# EAGLE design BeebOPL (EAGLE 7.7.0)
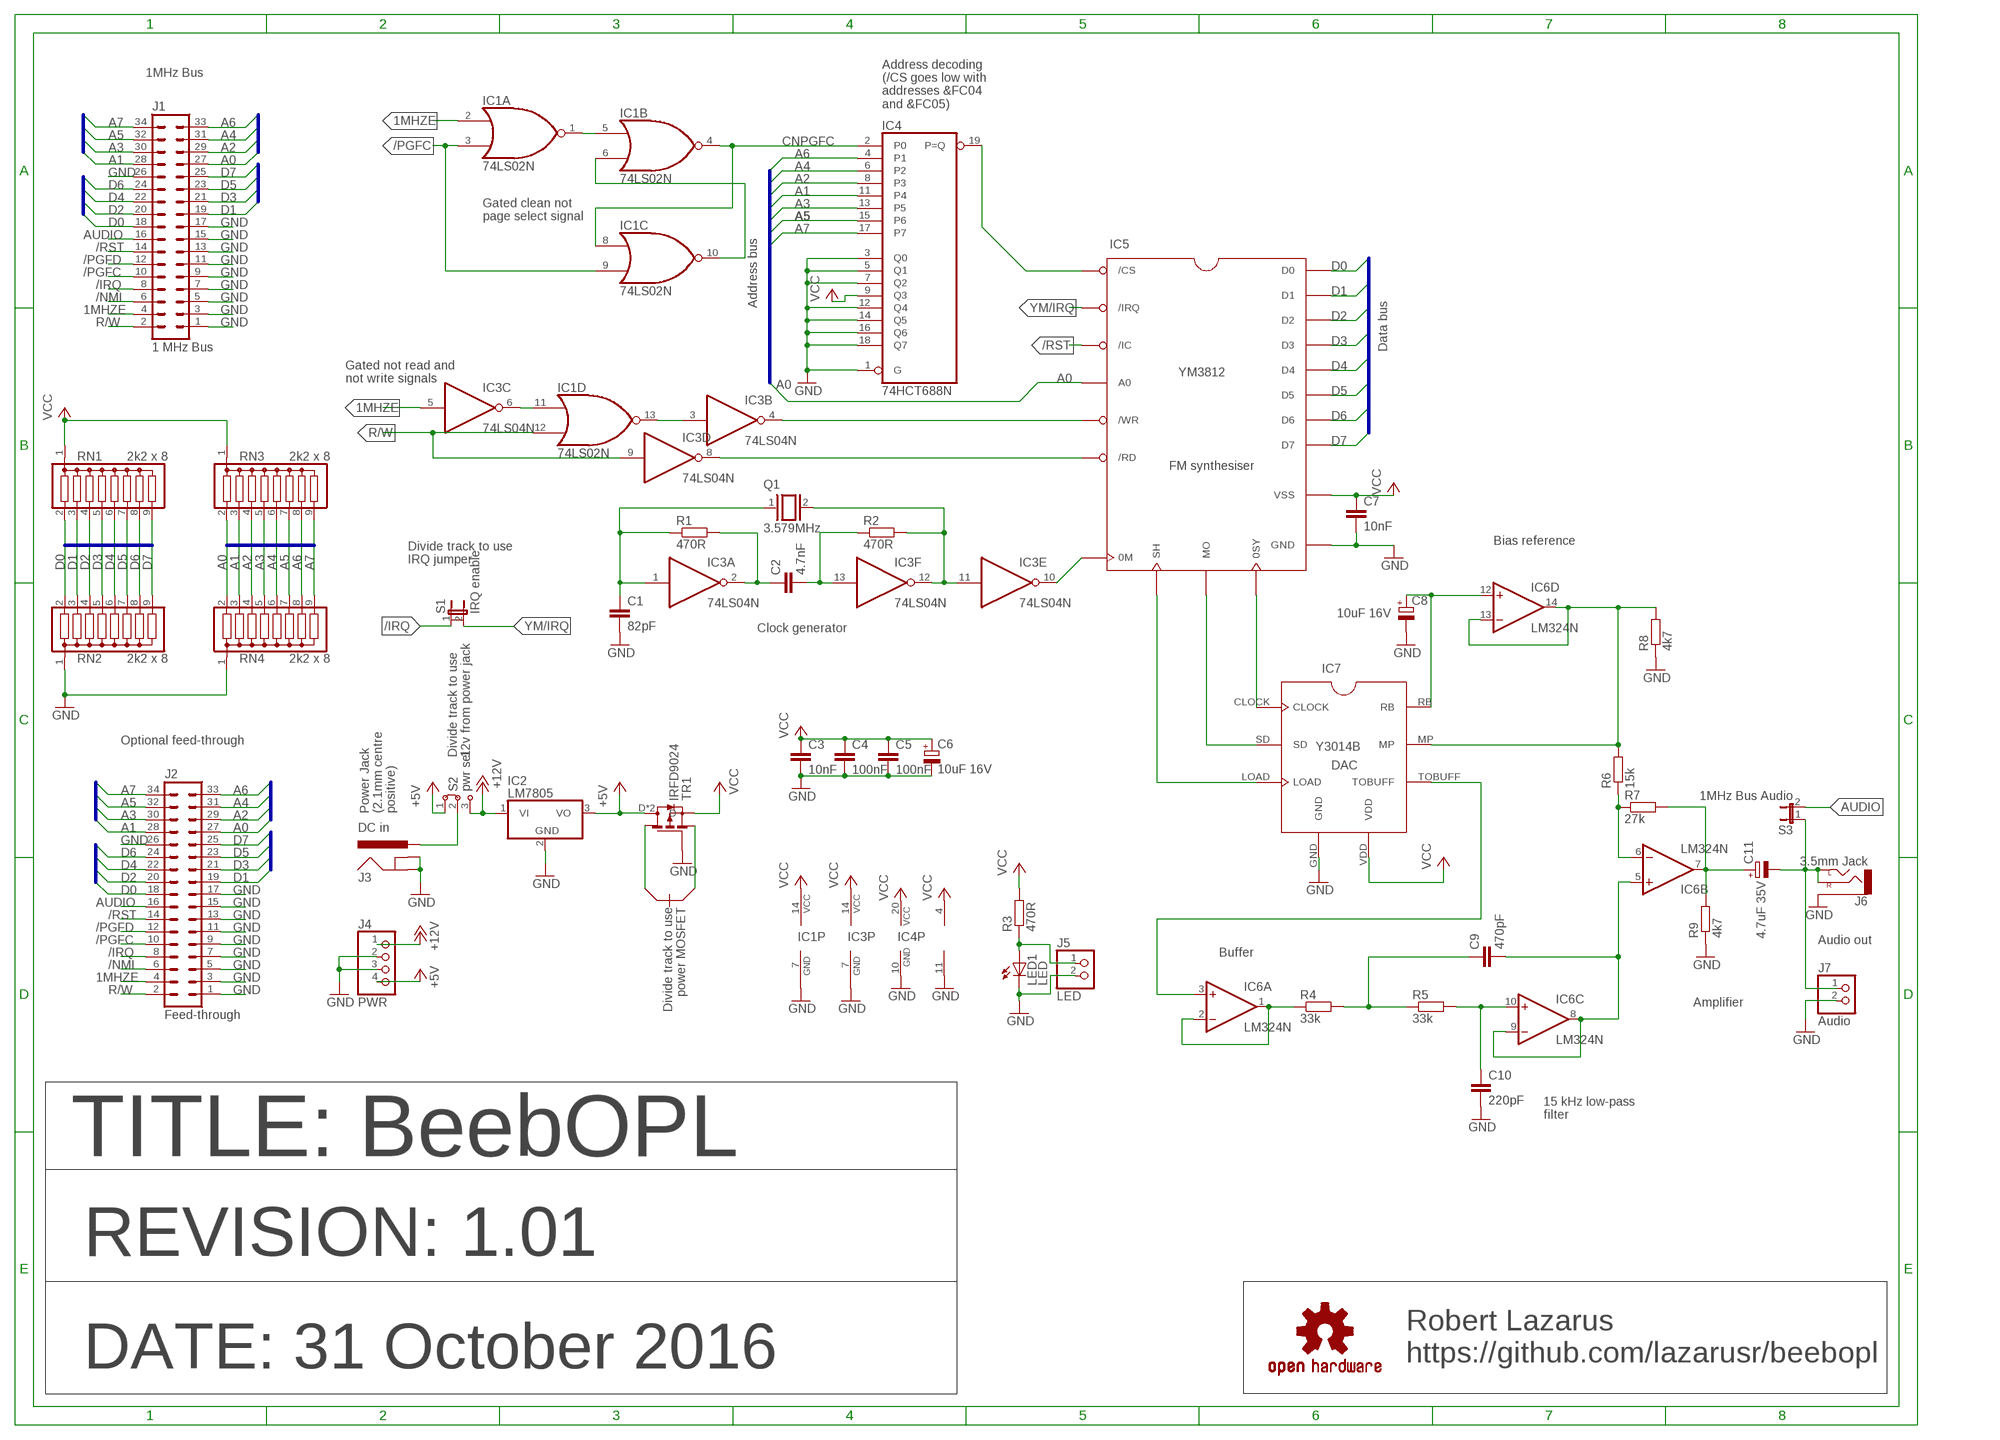
[diagram p0: schematic, sheet 1]

## Parts
C1  82pF  C-EU050-024X044  [C050-024X044]
C2  4.7nF  C-EU050-024X044  [C050-024X044]
C3  10nF  C-EU050-024X044  [C050-024X044]
C4  100nF  C-EU050-024X044  [C050-024X044]
C5  100nF  C-EU050-024X044  [C050-024X044]
C6  10uF 16V  CPOL-EUE2.5-5  [E2,5-5]
C7  10nF  C-EU050-024X044  [C050-024X044]
C8  10uF 16V  CPOL-EUE2.5-5  [E2,5-5]
C9  470pF  C-EU050-024X044  [C050-024X044]
C10  220pF  C-EU050-024X044  [C050-024X044]
C11  4.7uF 35V  CPOL-EUE2.5-5  [E2,5-5]
IC1  74LS02N  [DIL14]
IC2  LM7805  7805TV  [TO220V]
IC3  74LS04N  [DIL14]
IC4  74HCT688N  [DIL20]
IC5  YM3812  YM3812-DIP24  [YM3812]
IC6  LM324N  [DIL14]
IC7  Y3014B  YM3014B-DIP8  [YM3014B]
J1  1 MHz Bus  ML34  [ML34]
J2  Feed-through  ML34  [ML34]
J3  DC in  POWER_JACKSLT  [POWER_JACK_SLOT]
J4  PWR  PINHD-1X4  [1X04]
J5  LED  PINHD-1X2  [1X02]
J6  3.5mm Jack  AUDIO-JACKPTH  [AUDIO-JACK]
J7  Audio  PINHD-1X2  [1X02]
LED1  LED  LED5MM  [LED5MM]
LOGO1  OSHW-LOGO-BOTTOML  [OSHW-LOGO-L]
Q1  3.579MHz  XTAL/S  [QS]
R1  470R  R-EU_0207/10  [0207/10]
R2  470R  R-EU_0207/10  [0207/10]
R3  470R  R-EU_0207/10  [0207/10]
R4  33k  R-EU_0207/10  [0207/10]
R5  33k  R-EU_0207/10  [0207/10]
R6  15k  R-EU_0207/10  [0207/10]
R7  27k  R-EU_0207/10  [0207/10]
R8  4k7  R-EU_0207/10  [0207/10]
R9  4k7  R-EU_0207/10  [0207/10]
RN1  2k2 x 8  G08R  [SIL9]
RN2  2k2 x 8  G08R  [SIL9]
RN3  2k2 x 8  G08R  [SIL9]
RN4  2k2 x 8  G08R  [SIL9]
S1  IRQ enable  JUMPER-2PTH  [1X02]
S2  pwr sel  J2  [S_3WAY_OR]
S3  1MHz Bus Audio  JUMPER-2PTH  [1X02]
TR1  IRFD9024  IRFD9024-OPTN  [FET-DIL-OPTN]

## Nets
1MHZE: IC1.2(A:I0) IC3.5(C:I) J1.4 J2.4
+5V [pwr]: IC2.3(VO) J4.4 S2.1 TR1.D TR1.D1(D)
+12V [pwr]: IC2.1(VI) J4.1 S2.3
/IRQ: J1.8 J2.8 S1.1
/NMI: J1.6 J2.6
/PGFC: IC1.3(A:I1) IC1.9(C:I1) J1.10 J2.10
/PGFD: J1.12 J2.12
/RST: IC5./IC J1.14 J2.14
A0: IC5.A0 J1.27 J2.27 RN3.2 RN4.2
A1: IC4.11(P4) J1.28 J2.28 RN3.3 RN4.3
A2: IC4.8(P3) J1.29 J2.29 RN3.4 RN4.4
A3: IC4.13(P5) J1.30 J2.30 RN3.5 RN4.5
A4: IC4.6(P2) J1.31 J2.31 RN3.6 RN4.6
A5: IC4.15(P6) J1.32 J2.32 RN3.7 RN4.7
A6: IC4.4(P1) J1.33 J2.33 RN3.8 RN4.8
A7: IC4.17(P7) J1.34 J2.34 RN3.9 RN4.9
AUDIO [audio]: J1.16 J2.16 S3.2
AUDIO_OUT [audio]: C11.- J6.RING(RIGHT) J6.TIP(LEFT) J7.1 S3.1
CNPGFC: IC1.4(B:O) IC1.8(C:I0) IC4.2(P0)
D0: IC5.D0 J1.18 J2.18 RN1.2 RN2.2
D1: IC5.D1 J1.19 J2.19 RN1.3 RN2.3
D2: IC5.D2 J1.20 J2.20 RN1.4 RN2.4
D3: IC5.D3 J1.21 J2.21 RN1.5 RN2.5
D4: IC5.D4 J1.22 J2.22 RN1.6 RN2.6
D5: IC5.D5 J1.23 J2.23 RN1.7 RN2.7
D6: IC5.D6 J1.24 J2.24 RN1.8 RN2.8
D7: IC5.D7 J1.25 J2.25 RN1.9 RN2.9
DC [pwr]: J3.PWR S2.2
GND [gnd]: C1.2 C3.2 C4.2 C5.2 C6.- C7.2 C8.- C10.2 IC1.7(P:GND) IC2.2(GND) IC3.7(P:GND) IC4.1(G) IC4.3(Q0) IC4.5(Q1) IC4.7(Q2) IC4.10(GND) IC4.12(Q4) IC4.14(Q5) IC4.16(Q6) IC4.18(Q7) IC5.GND IC6.11(P:V-) IC7.GND J1.1 J1.3 J1.5 J1.7 J1.9 J1.11 J1.13 J1.15 J1.17 J1.26 J2.1 J2.3 J2.5 J2.7 J2.9 J2.11 J2.13 J2.15 J2.17 J2.26 J3.GND@1(GNDBREAK) J3.GND@2(GND) J4.2 J4.3 J5.2 J6.SLEEVE J7.2 LED1.K(C) R8.1 R9.1 RN2.1 RN4.1 TR1.G
N$1: C2.1 IC3.2(A:O) R1.2
N$2: IC1.13(D:O) IC3.3(B:I)
N$3: IC1.11(D:I0) IC3.6(C:O)
N$5: C2.2 IC3.13(F:I) R2.1
N$6: IC5.SH IC7.LOAD
N$7: IC5.MO IC7.SD
N$8: IC5.0SY IC7.CLOCK
N$9: C1.1 IC3.1(A:I) Q1.1 R1.1
N$10: IC1.1(A:O) IC1.5(B:I0)
N$11 [audio]: C8.+ IC6.12(D:+IN) IC7.RB
N$12: IC1.6(B:I1) IC1.10(C:O)
N$13 [audio]: IC6.13(D:-IN) IC6.14(D:OUT) IC7.MP R6.2 R8.2
N$14: IC3.8(D:O) IC5./RD
N$15 [audio]: IC6.6(B:-IN) R6.1 R7.1
N$16 [audio]: C11.+ IC6.7(B:OUT) R7.2 R9.2
N$18 [audio]: IC6.3(A:+IN) IC7.TOBUFF
N$19 [audio]: IC6.1(A:OUT) IC6.2(A:-IN) R4.1
N$20 [audio]: C9.1 R4.2 R5.1
N$21 [audio]: C10.1 IC6.10(C:+IN) R5.2
N$22 [audio]: C9.2 IC6.5(B:+IN) IC6.8(C:OUT) IC6.9(C:-IN)
N$23: IC4.19(P=Q) IC5./CS
N$24: IC3.4(B:O) IC5./WR
N$25: J5.1 LED1.A R3.1
N$26: IC3.10(E:O) IC5.0M
N$28: IC3.11(E:I) IC3.12(F:O) Q1.2 R2.2
R/W: IC1.12(D:I1) IC3.9(D:I) J1.2 J2.2
VCC [pwr]: C3.1 C4.1 C5.1 C6.+ C7.1 IC1.14(P:VCC) IC3.14(P:VCC) IC4.9(Q3) IC4.20(VCC) IC5.VSS IC6.4(P:V+) IC7.VDD R3.2 RN1.1 RN3.1 TR1.S
YM/IRQ: IC5./IRQ S1.2

## Buses
D[0..7]
A[0..7]

## Notes on the sheet
- 1MHz Bus
- Address decoding
  (/CS goes low with
  addresses &FC04
  and &FC05)
- Gated clean not
  page select signal
- Address bus
- Data bus
- Gated not read and
  not write signals
- FM synthesiser
- Bias reference
- Divide track to use
  IRQ jumper
- Clock generator
- Optional feed-through
- Divide track to use
  12v from power jack
- DAC
- Power Jack
  (2.1mm centre
  positive)
- Divide track to use
  power MOSFET
- Audio out
- Buffer
- Amplifier
- 15 kHz low-pass
  filter
- TITLE: BeebOPL
- REVISION: 1.01
- Robert Lazarus
  https://github.com/lazarusr/beebopl
- DATE: 31 October 2016

## Library data of the parts
C1-C5 C7 C9 C10 = resistor:C-EU: CAPACITOR, European symbol
C6 C8 C11 = YMSynth:CPOL-EU: POLARIZED CAPACITOR, European symbol
IC1 = 74xx-us:74*02: Quad 2-input NOR gate
IC2 = linear:78*: Positive VOLTAGE REGULATOR Source: http://cache.national.com/ds/LM/LM78L05.pdf http://www.fairchildsemi.com/ds/LM/LM7805.pdf
IC3 = 74xx-us:74*04: Hex INVERTER
IC4 = 74xx-eu:74*688: 8-bit MAGNITUDE/IDENTITY COMPARATOR, totem pole
IC5 = YMSynth:YM3812: YM3812
IC6 = linear:LM324: OP AMP
IC7 = YMSynth:YM3014B: YM3014B
J1 J2 = con-harting-ml:ML34: HARTING; OC_FARNELL: unknown; OC_NEWARK: unknown
J3 = SparkFun-Connectors:POWER_JACK: Power Jack This is the standard 5.5mm barrel jack for power. The PTH is the most common, proven, reliable, footprint. The Slot footprint only works if the mill layer is transmitted to the PCB fab house so be warned. Mating wall wart : TOL-00298 (and others); PROD_ID: PRT-00119
J4 = pinhead:PINHD-1X4: PIN HEADER
J5 J7 = pinhead:PINHD-1X2: PIN HEADER
J6 = SparkFun-Connectors:AUDIO-JACK: 3.5mm Audio Jack Simple 3.5mm common PCB mount audio jack. Variant PTH is our storefront SKU PRT-08032
LED1 = led:LED: LED OSRAM: - CHIPLED LG R971, LG N971, LY N971, LG Q971, LY Q971, LO R971, LY R971 LH N974, LH R974 LS Q976, LO Q976, LY Q976 LO Q996 - Hyper CHIPLED LW Q18S LB Q993, LB Q99A, LB R99A - SideLED LS A670, LO A670, LY A670, LG A670, LP A670 LB A673, LV A673, LT A673, LW A673 LH A674 LY A675 LS A676, LA A676, LO A676, LY A676, LW A676 LS A679, LY A679, LG A679 - Hyper Micro SIDELED® LS Y876, LA Y876, LO Y876, LY Y876 LT Y87S - SmartLED LW L88C, LW L88S LB L89C, LB L89S, LG L890 LS L89K, LO L89K, LY L89K LS L896, LA L896, LO L896, LY L896 - TOPLED LS T670, LO T670, LY T670, LG T670, LP T670 LSG T670, LSP T670, LSY T670, LOP T670, LYG T670 LG T671, LOG T671, LSG T671 LB T673, LV T673, LT T673, LW T673 LH T674 LS T676, LA T676, LO T676, LY T676, LB T676, LH T676, LSB T676, LW T676 LB T67C, LV T67C, LT T67C, LS T67K, LO T67K, LY T67K, LW E67C LS E67B, LA E67B, LO E67B, LY E67B, LB E67C, LV E67C, LT E67C LW T67C LS T679, LY T679, LG T679 LS T770, LO T770, LY T770, LG T770, LP T770 LB T773, LV T773, LT T773, LW T773 LH T774 LS E675, LA E675, LY E675, LS T675 LS T776, LA T776, LO T776, LY T776, LB T776 LHGB T686 LT T68C, LB T68C - Hyper Mini TOPLED® LB M676 - Mini TOPLED Santana® LG M470 LS M47K, LO M47K, LY M47K Source: http://www.osram.convergy.de LUXEON: - LUMILED® LXK2-PW12-R00, LXK2-PW12-S00, LXK2-PW14-U00, LXK2-PW14-V00 LXK2-PM12-R00, LXK2-PM12-S00, LXK2-PM14-U00 LXK2-PE12-Q00, LXK2-PE12-R00, LXK2-PE12-S00, LXK2-PE14-T00, LXK2-PE14-U00 LXK2-PB12-K00, LXK2-PB12-L00, LXK2-PB12-M00, LXK2-PB14-N00, LXK2-PB14-P00, LXK2-PB14-Q00 LXK2-PR12-L00, LXK2-PR12-M00, LXK2-PR14-Q00, LXK2-PR14-R00 LXK2-PD12-Q00, LXK2-PD12-R00, LXK2-PD12-S00 LXK2-PH12-R00, LXK2-PH12-S00 LXK2-PL12-P00, LXK2-PL12-Q00, LXK2-PL12-R00 Source: www.luxeon.com KINGBRIGHT: KA-3528ASYC Source: www.kingbright.com
LOGO1 = YMSynth:OSHW-LOGO-BOTTOM: Open Source Hardware Logo This logo indicates the piece of hardware it is found on incorporates a OSHW license and/or adheres to the definition of open source hardware found here: http://freedomdefined.org/OSHW
Q1 = special:XTAL/S: CRYSTAL
R1-R9 = resistor:R-EU_: RESISTOR, European symbol
RN1-RN4 = resistor-sil:G08R: SIL RESISTOR; OC_FARNELL: unknown; OC_NEWARK: unknown
S1 = YMSynth:JUMPER-2: Jumper Basic 0.1" spaced jumper. Use with breakaway headers.
S2 = YMSynth:J2: Jumper switch 2 x 2.5 mm
S3 = SparkFun-Retired:JUMPER-2: Jumper Basic 0.1" spaced jumper. Use with breakaway headers.
TR1 = YMSynth:IRFD9024-OPTN

## Net classes
0 default: width 0.254 mm, clearance 0.152 mm
1 pwr: width 1.016 mm, clearance 0.254 mm
2 audio: width 1.016 mm, clearance 0.254 mm
3 gnd: width 1.016 mm, clearance 0.254 mm

## Board
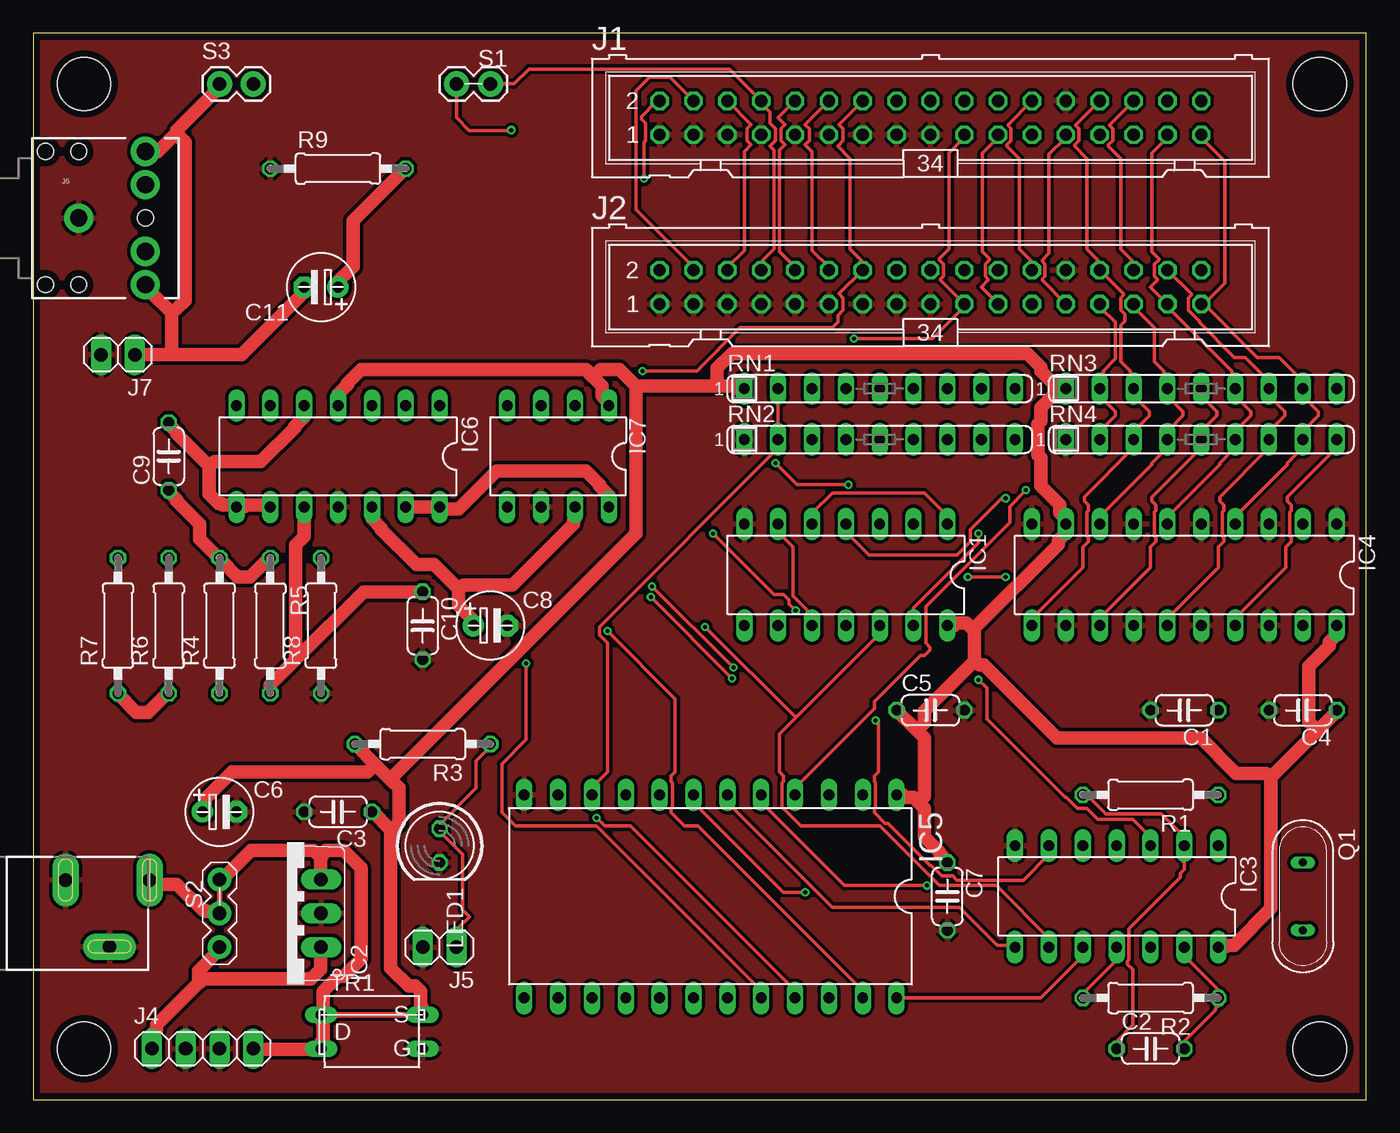
[diagram p1: board, top side]
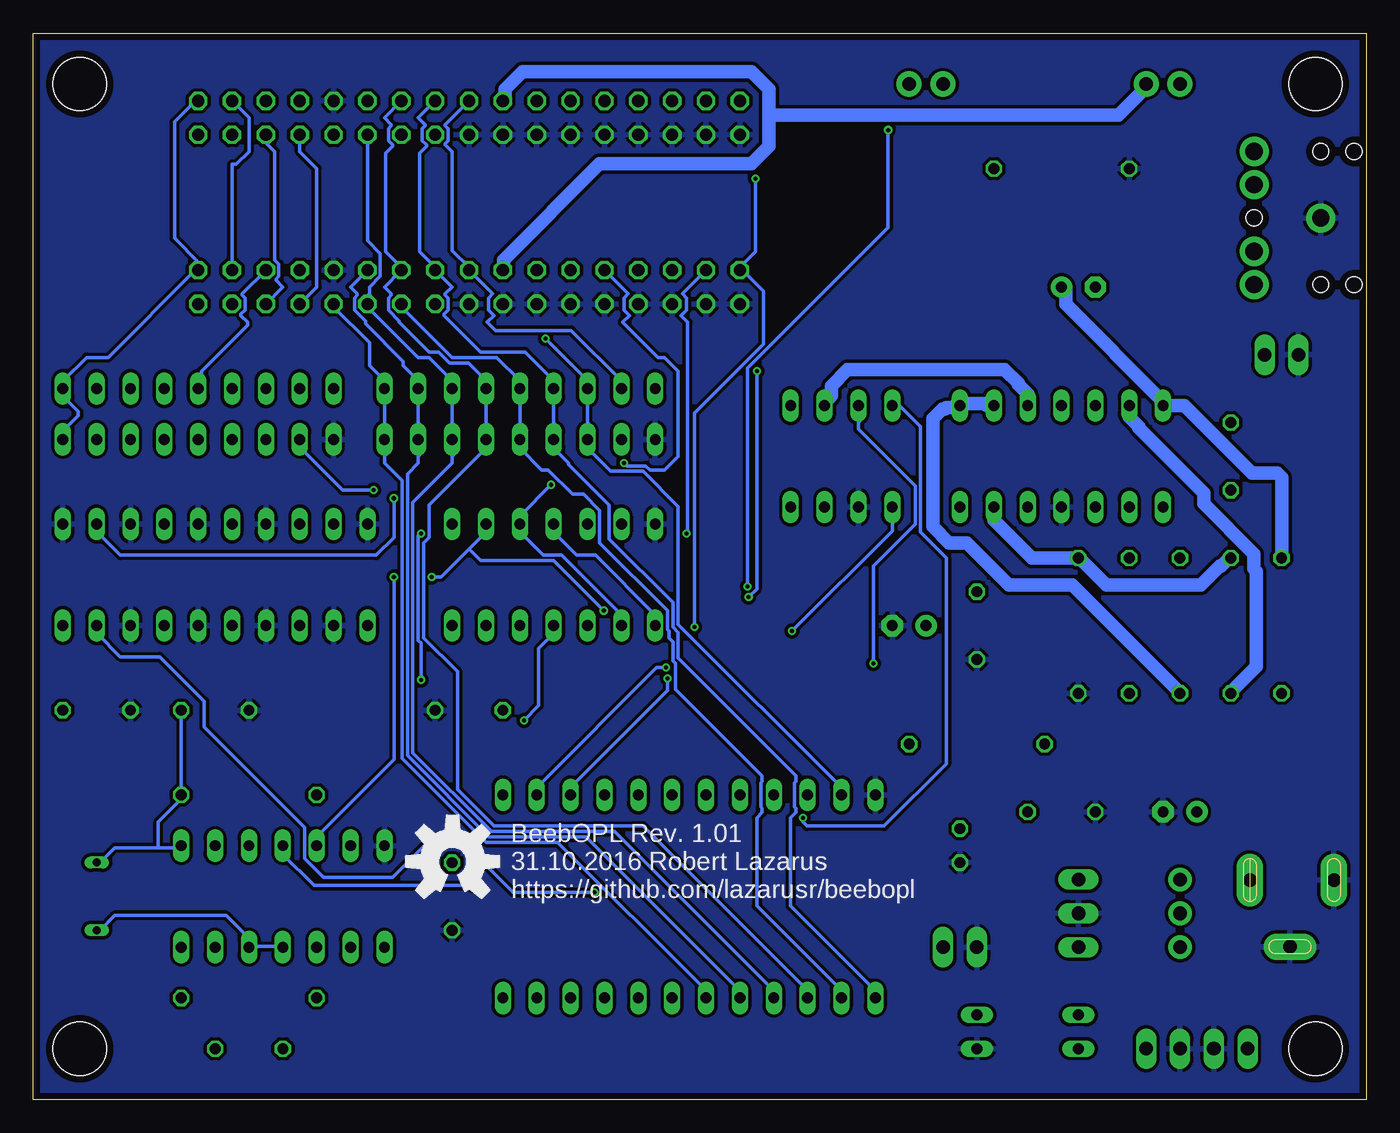
[diagram p2: board, bottom side, seen from below]

Size 100 x 80 mm. Coordinates in mm from the lower left corner, seen from the top.
Outline: 0,0 100,0 100,80 0,80 0,0
Copper layers (1*16): Top 0.035mm / dielectric 1.6mm / Bottom 0.035mm
Design rules "Elecrow_2-layer_PCB_eagle_rule": minimum track width 6mil, minimum drill 12mil, track to track 6mil, track to pad 6mil, pad to pad 6mil, via to via 8mil, smd to smd 0mil, copper to edge 20mil, drill to drill 10mil, minimum pad ring 6mil, minimum via ring 6mil, stop-mask expansion 0mil, vias tented up to drill 100mil, thermal gap 10mil
Holes 4 mm at 96.52,76.2 96.52,3.81 3.81,3.81 3.81,76.2

### Footprints (pad centres in the part's own frame; a part is rotated, then mirrored left to right if it is on the bottom)
C050-024X044 = drill 0.813 octagon: 1 -2.54,0; 2 2.54,0
E2,5-5 = drill 0.813 pad 1.6: + -1.27,0 | drill 0.813 pad 1.6 octagon: - 1.27,0
DIL14 = drill 0.813 long: 1 -7.62,-3.81; 2 -5.08,-3.81; 3 -2.54,-3.81; 4 0,-3.81; 5 2.54,-3.81; 6 5.08,-3.81; 7 7.62,-3.81; 8 7.62,3.81; 9 5.08,3.81; 10 2.54,3.81; 11 0,3.81; 12 -2.54,3.81; 13 -5.08,3.81; 14 -7.62,3.81
TO220V = drill 1.016 long: 1 -2.54,-2.54; 2 0,-2.54; 3 2.54,-2.54
DIL20 = drill 0.813 long: 1 -11.43,-3.81; 2 -8.89,-3.81; 3 -6.35,-3.81; 4 -3.81,-3.81; 5 -1.27,-3.81; 6 1.27,-3.81; 7 3.81,-3.81; 8 6.35,-3.81; 9 8.89,-3.81; 10 11.43,-3.81; 11 11.43,3.81; 12 8.89,3.81; 13 6.35,3.81; 14 3.81,3.81; 15 1.27,3.81; 16 -1.27,3.81; 17 -3.81,3.81; 18 -6.35,3.81; 19 -8.89,3.81; 20 -11.43,3.81
YM3812 = drill 0.813 long: 0M -13.97,7.62; 0SY -11.43,7.62; /CS 1.27,-7.62; /IC -8.89,-7.62; /IRQ -11.43,-7.62; /RD -1.27,-7.62; /WR -3.81,-7.62; A0 -6.35,-7.62; D0 8.89,-7.62; D1 11.43,-7.62; D2 13.97,7.62; D3 11.43,7.62; D4 8.89,7.62; D5 6.35,7.62; D6 3.81,7.62; D7 1.27,7.62; GND 13.97,-7.62; MO -6.35,7.62; NC8 3.81,-7.62; NC9 6.35,-7.62; NC19 -1.27,7.62; NC22 -8.89,7.62; SH -3.81,7.62; VSS -13.97,-7.62
YM3014B = drill 0.813 long: CLOCK 3.81,3.81; GND 1.27,3.81; LOAD 1.27,-3.81; MP -3.81,3.81; RB -1.27,3.81; SD 3.81,-3.81; TOBUFF -1.27,-3.81; VDD -3.81,-3.81
ML34 = drill 0.914 octagon: 1 -20.32,-1.27; 2 -20.32,1.27; 3 -17.78,-1.27; 4 -17.78,1.27; 5 -15.24,-1.27; 6 -15.24,1.27; 7 -12.7,-1.27; 8 -12.7,1.27; 9 -10.16,-1.27; 10 -10.16,1.27; 11 -7.62,-1.27; 12 -7.62,1.27; 13 -5.08,-1.27; 14 -5.08,1.27; 15 -2.54,-1.27; 16 -2.54,1.27; 17 0,-1.27; 18 0,1.27; 19 2.54,-1.27; 20 2.54,1.27; 21 5.08,-1.27; 22 5.08,1.27; 23 7.62,-1.27; 24 7.62,1.27; 25 10.16,-1.27; 26 10.16,1.27; 27 12.7,-1.27; 28 12.7,1.27; 29 15.24,-1.27; 30 15.24,1.27; 31 17.78,-1.27; 32 17.78,1.27; 33 20.32,-1.27; 34 20.32,1.27
POWER_JACK_SLOT = drill 1 pad 2 long: GND@1 2.58,7.5; GND@2 7.58,10.8; PWR 2.58,13.8
1X04 = drill 1.016 long: 1 -3.81,0; 2 -1.27,0; 3 1.27,0; 4 3.81,0
1X02 = drill 1.016 long: 1 -1.27,0; 2 1.27,0
AUDIO-JACK = drill 1.3 pad 2.184: RING 5,5; RSH 5,2.5; SLEEVE 0,0; TIP 5,-5; TSH 5,-2.5 | hole 1.2: 0,5; -2.5,5; -2.5,-5; 0,-5; 5,0
LED5MM = drill 0.813 octagon: A -1.27,0; K 1.27,0
QS = drill 0.61 long: 1 -2.54,0; 2 2.54,0
0207/10 = drill 0.813 octagon: 1 -5.08,0; 2 5.08,0
SIL9 = drill 0.813 long: 1 -10.16,0; 2 -7.62,0; 3 -5.08,0; 4 -2.54,0; 5 0,0; 6 2.54,0; 7 5.08,0; 8 7.62,0; 9 10.16,0
1X02' = drill 1.016 pad 1.88: 1 0,0; 2 2.54,0
S_3WAY_OR = drill 1.016 pad 1.778: 1 -1.27,0; 2 1.27,0; 3 3.81,0
FET-DIL-OPTN = drill 0.813 long: D -3.81,1.27; D1 -3.81,-1.27; G 3.81,-1.27; S 3.81,1.27

### Placement (x,y rotation side)
C1  86.36,29.21 180 top
C2  83.82,3.81 0 top
C3  22.86,21.59 180 top
C4  95.25,29.21 180 top
C5  67.31,29.21 0 top
C6  13.97,21.59 0 top
C7  68.58,15.24 270 top
C8  34.29,35.56 0 top
C9  10.16,48.26 90 top
C10  29.21,35.56 270 top
C11  21.59,60.96 180 top
IC1  60.96,39.37 180 top
IC2  19.05,13.97 90 top
IC3  81.28,15.24 180 top
IC4  86.36,39.37 180 top
IC5  50.8,15.24 180 top
IC6  22.86,48.26 180 top
IC7  39.37,48.26 180 top
J1  67.31,73.66 0 top
J2  67.31,60.96 0 top
J3  -5.08,19.05 270 top
J4  12.7,3.81 0 top
J5  30.48,11.43 180 top
J6  3.4,66.14 0 top
J7  6.35,55.88 180 top
LED1  30.48,19.05 270 top
LOGO1  68.54,17.86 0 top
Q1  95.25,15.24 270 top
R1  83.82,22.86 180 top
R2  83.82,7.62 180 top
R3  29.21,26.67 180 top
R4  13.97,35.56 90 top
R5  17.78,35.56 270 top
R6  10.16,35.56 90 top
R7  6.35,35.56 90 top
R8  21.59,35.56 90 top
R9  22.86,69.85 0 top
RN1  63.5,53.34 0 top
RN2  63.5,49.53 0 top
RN3  87.63,53.34 0 top
RN4  87.63,49.53 0 top
S1  IRQ enable  [1X02']  34.29,76.2 180 top
S2  13.97,15.24 270 top
S3  1MHz Bus Audio  [1X02']  13.97,76.2 0 top
TR1  25.4,5.08 0 top

### Tracks (layer width: path | path; a pad name or v marks a point on that pad's centre or on a via)
1MHZE  (via drill 0.3)
  Top 0.254: J1.4 47.75,76.71 46.23,76.71 45.21,75.69 45.21,66.75 49.48,62.48 49.48,62.28 J2.4 | v70.1,39.22 v72.95,39.22 | v51,42.47 55.58,37.9 56.29,37.9 56.69,37.49 56.69,37.19 v57.2,36.68
  Bottom 0.254: IC3.5 78.74,19.71 72.95,25.5 v72.95,39.22 | v70.1,39.22 69.39,39.22 67.31,41.3 | 67.31,41.3 66.04,42.57 IC1.2 | J2.4 51.31,60.45 51,60.15 51,59.23 51.41,58.83 50.9,58.32 50.9,42.57 v51,42.47 | 67.31,41.3 66.45,40.44 60.96,40.44 v57.2,36.68
+5V
  Top 1.016: J4.4 16.56,3.76 21.54,3.76 TR1.D1 21.64,3.86 21.64,4.37 21.74,4.47 21.74,5.79 21.34,6.2 21.54,6.4 TR1.D 21.74,6.81 21.74,8.13 22.86,9.25 23.27,9.25 24.59,10.57 24.59,17.37 23.27,18.69 21.95,18.69 21.84,18.59 21.54,18.19 | 21.54,18.19 21.54,16.56 IC2.3 | 21.54,18.19 21.03,18.69 16.36,18.69 14.22,16.56 14.02,16.56 S2.1
+12V
  Top 1.016: 12.39,8.74 9.25,5.59 9.25,5.28 8.94,4.98 8.94,3.86 J4.1 | 12.39,8.74 12.39,9.65 13.92,11.18 13.92,11.38 S2.3 | IC2.1 21.54,11.38 21.54,9.75 20.83,9.04 12.8,9.04 12.39,8.74
/IRQ
  Top 0.254: J2.8 54.66,62.28 54.66,62.89 55.58,63.8 55.58,71.22 55.27,71.53 55.68,71.93 55.68,72.85 55.27,73.25 55.27,74.07 54.66,74.68 54.66,74.88 J1.8 52.22,77.32 37.19,77.32 36.07,76.2 S1.1
/NMI
  Top 0.254: J1.6 53.85,73.15 53.54,72.85 53.54,71.93 53.85,71.63 53.34,71.12 53.34,63.7 52.12,62.48 52.12,62.28 J2.6
/PGFC  (via drill 0.3)
  Top 0.254: J1.10 55.88,73.66 56.39,73.15 56.08,72.85 56.08,71.93 56.39,71.63 55.98,71.22 55.98,63.6 57.1,62.48 57.1,62.28 J2.10 | v55.68,47.75 57.3,46.13 v61.16,46.13
  Bottom 0.254: IC1.9 55.88,36.37 60.35,40.84 61.77,40.84 63.5,42.57 IC1.3 63.5,43.79 v61.16,46.13 | J2.10 55.37,60.45 55.68,60.15 55.68,59.23 55.27,58.83 55.78,58.32 53.14,55.68 52.63,55.68 51.61,54.66 51.61,48.26 52.63,47.24 53.75,47.24 54.05,47.55 55.47,47.55 v55.68,47.75
/PGFD
  Top 0.254: J1.12 57.91,73.15 58.22,72.85 58.22,71.93 57.91,71.63 58.42,71.12 58.42,63.7 59.64,62.48 59.64,62.28 J2.12
/RST  (via drill 0.3)
  Top 0.254: v46.33,37.69 v52.43,31.6 | v45.72,54.66 49.78,54.66 53.03,57.91 59.94,57.91 60.35,58.32 60.35,58.83 60.76,59.23 60.76,60.15 60.45,60.45 J2.14 62.28,62.28 62.28,62.79 61.27,63.8 61.27,70.61 60.35,71.53 60.76,71.93 60.76,72.85 60.45,73.15 J1.14
  Bottom 0.254: v52.43,31.6 52.43,30.68 59.64,23.47 59.64,22.86 IC5./IC | v46.33,37.69 45.72,38.3 v45.72,54.66
A0  (via drill 0.3)
  Top 0.254: v74.47,45.72 73.25,44.5 73.25,43.28 66.95,36.98 66.95,34.24 67.26,33.93 67.26,33.73 66.85,33.33 66.55,33.33 63.09,29.87 63.09,29.36 57.2,23.47 57.2,22.86 IC5.A0 | RN4.2 80.06,49.58 80.06,50.19 81.18,51.31 81.18,51.61 80.06,52.73 80.06,53.34 RN3.2 80.06,53.44 80.06,54.36 80.26,54.56 80.26,54.66 81.18,55.58 81.18,58.32 80.06,59.44 80.06,59.64 J2.27
  Bottom 0.254: v74.47,45.72 76.81,45.72 79.96,48.87 79.96,49.48 RN4.2 | J2.27 78.74,60.96 78.74,69.85 80.01,71.12 J1.27
A1
  Top 0.254: IC4.11 74.98,35.56 74.98,36.17 78.74,39.93 78.74,41.45 79.15,41.86 79.15,42.16 79.05,42.27 79.05,44.09 79.15,44.2 79.15,44.6 78.84,44.91 78.84,45.21 82.5,48.87 82.5,49.48 RN4.3 82.6,49.58 82.6,50.19 83.72,51.31 83.72,51.61 82.6,52.73 82.6,53.34 RN3.3 82.5,53.44 82.5,54.36 82.3,54.56 82.3,54.66 81.58,55.37 81.58,58.12 81.89,58.42 81.89,58.93 81.58,59.23 81.58,60.15 81.79,60.35 81.79,60.45 J2.28 80.06,62.28 80.06,62.79 79.05,63.8 79.05,70.61 78.13,71.53 78.13,71.63 78.44,71.93 78.44,72.85 78.23,73.05 78.23,73.15 J1.28
A2
  Top 0.254: IC4.8 80.06,43.18 80.06,43.79 83.92,47.65 83.92,47.75 85.04,48.87 85.04,49.48 RN4.4 85.14,49.58 85.14,50.19 86.26,51.31 86.26,51.61 85.14,52.73 85.14,53.34 RN3.4 85.04,53.44 85.04,54.36 84.84,54.56 84.84,54.66 84.12,55.37 84.12,57.91 82.6,59.44 82.6,59.64 J2.29
  Bottom 0.254: J2.29 81.28,60.96 81.79,61.47 81.79,61.57 81.58,61.77 81.58,62.69 81.89,62.99 81.89,71.12 82.5,71.73 82.5,72.34 J1.29
A3
  Top 0.254: IC4.13 80.06,35.56 80.06,36.17 83.82,39.93 83.82,41.45 84.23,41.86 84.23,42.16 84.12,42.27 84.12,44.09 84.23,44.2 84.23,44.6 83.92,44.91 83.92,45.21 87.58,48.87 87.58,49.48 RN4.5 87.68,49.58 87.68,50.19 88.8,51.31 88.8,51.61 87.68,52.73 87.68,53.34 RN3.5 | J1.30 80.77,73.15 80.77,73.05 80.97,72.85 80.97,71.93 80.67,71.63 80.67,71.53 81.58,70.61 81.58,63.8 82.6,62.79 82.6,62.28 J2.30
  Bottom 0.254: J2.30 84.33,60.45 84.33,60.35 84.12,60.15 84.12,59.23 84.43,58.93 84.43,58.83 83.92,58.32 83.92,58.12 87.38,54.66 87.38,54.56 87.58,54.36 87.58,53.34 RN3.5
A4
  Top 0.254: IC4.6 85.14,43.18 85.14,43.79 89,47.65 89,47.75 90.12,48.87 90.12,49.48 RN4.6 90.22,49.58 90.22,50.19 91.34,51.31 91.34,51.61 90.22,52.73 90.22,53.34 RN3.6 90.12,53.44 90.12,54.36 89.92,54.56 89.92,54.66 85.14,59.44 85.14,59.64 J2.31 83.82,60.96 84.33,61.47 84.33,61.57 84.12,61.77 84.12,62.69 84.43,62.99 84.43,63.09 83.92,63.6 83.92,71.02 85.04,72.14 85.04,72.34 J1.31
A5
  Top 0.254: IC4.15 85.14,35.56 85.14,36.17 88.9,39.93 88.9,41.45 89.31,41.86 89.31,42.16 89.2,42.27 89.2,44.09 89.31,44.2 89.31,44.6 89,44.91 89,45.21 92.66,48.87 92.66,49.48 RN4.7 92.76,49.58 92.76,50.19 93.88,51.31 93.88,51.61 92.76,52.73 92.76,53.34 RN3.7 92.66,53.44 92.66,53.95 90.93,55.68 90.12,55.68 87.48,58.32 87.48,58.42 86.67,59.23 86.67,60.15 86.87,60.35 86.87,60.45 J2.32
  Bottom 0.254: J2.32 85.09,70.17 84.77,70.17 83.82,71.12 83.82,73.66 J1.32
A6
  Top 0.254: IC4.4 90.22,43.18 90.22,43.79 94.08,47.65 94.08,47.75 95.2,48.87 95.2,49.48 RN4.8 95.3,49.58 95.3,50.19 96.42,51.31 96.42,51.61 95.3,52.73 95.3,53.34 RN3.8 95.2,53.44 95.2,53.95 93.47,55.68 91.85,55.68 87.88,59.64 87.68,59.64 J2.33 87.88,59.74 89.41,61.27 89.41,70.41 87.68,72.14 87.68,72.34 J1.33
A7
  Top 0.254: IC4.17 90.22,35.56 90.22,36.17 93.98,39.93 93.98,41.45 94.39,41.86 94.39,42.16 94.28,42.27 94.28,44.09 94.39,44.2 94.39,44.6 94.08,44.91 94.08,45.21 97.74,48.87 97.74,49.48 RN4.9
  Bottom 0.254: RN4.9 97.74,49.58 97.74,50.19 96.62,51.31 96.62,51.61 97.74,52.73 97.74,53.34 RN3.9 97.74,53.44 97.74,53.95 96.01,55.68 94.39,55.68 87.88,62.18 87.68,62.18 J2.34 87.58,62.28 87.58,62.79 89.41,64.62 89.41,73.36 87.88,74.88 87.68,74.88 J1.34
AUDIO
  Bottom 1.016: 44.81,73.86 44.81,75.79 46.13,77.11 63.3,77.11 64.62,75.79 64.62,75.18 64.82,74.98 J1.16 | 44.81,73.86 44.81,71.53 46.13,70.21 57.51,70.21 64.72,62.99 64.72,62.28 J2.16 | 44.81,73.86 18.59,73.86 16.56,75.89 16.56,76.2 S3.2
AUDIO_OUT
  Top 1.016: 10.77,72.54 10.77,72.75 13.92,75.89 13.92,76.2 S3.1 | 10.77,72.54 9.35,71.12 8.84,71.12 J6.RING | J7.1 10.36,55.88 | 10.36,55.88 15.65,55.88 20.52,60.76 20.52,60.96 C11.- | 10.36,59.03 8.84,60.55 8.84,60.96 J6.TIP | 10.36,55.88 10.36,59.03 | 10.77,72.54 11.07,72.14 11.38,71.83 11.38,59.94 10.77,59.33 10.36,59.03
CNPGFC  (via drill 0.3)
  Top 0.254: v72.95,45.11 72.64,45.11 70.31,42.77 70.31,41.86 69.29,40.84 62.69,40.84 60.96,42.57 IC1.4
  Bottom 0.254: IC1.8 53.34,36.37 57.81,40.84 59.23,40.84 60.96,42.57 IC1.4 | v72.95,45.11 72.95,42.16 74.27,40.84 93.47,40.84 95.2,42.57 95.2,43.18 IC4.2
D0
  Top 0.254: IC5.D0 41.96,22.86 41.96,23.47 43.08,24.59 43.08,34.24 42.47,34.85 42.47,35.46 55.88,48.87 RN2.2 55.78,49.58 55.78,50.7 55.88,50.8 RN1.2
  Bottom 0.254: J1.18 69.09,73.15 69.09,73.05 68.89,72.85 68.89,71.93 69.09,71.73 69.09,71.63 68.58,71.12 68.58,63.7 67.36,62.48 67.36,62.28 J2.18 65.53,60.45 65.84,60.15 65.84,59.23 65.43,58.83 65.94,58.32 65.33,57.71 59.64,57.71 55.88,53.95 RN1.2
D1  (via drill 0.3)
  Top 0.254: J1.19 69.8,72.34 69.8,72.14 68.68,71.02 68.68,63.8 67.97,63.09 67.97,62.99 68.28,62.69 68.28,61.77 68.07,61.57 68.07,61.47 J2.19 69.8,59.64 69.8,59.44 67.46,57.1 v61.57,57.1
  Bottom 0.254: IC5.D1 39.42,22.86 39.42,23.47 51.61,35.66 51.61,44.5 54.25,47.14 56.69,47.14 58.42,48.87 RN2.3 58.32,49.58 58.32,50.7 58.42,50.8 RN1.3 58.42,53.95 v61.57,57.1
D2
  Bottom 0.254: J1.20 71.12,73.66 70.61,73.15 70.61,73.05 70.81,72.85 70.81,71.93 70.51,71.63 70.51,71.53 71.02,71.02 71.02,63.6 69.9,62.48 69.9,62.28 J2.20 68.58,60.96 69.09,60.45 69.09,60.35 68.89,60.15 68.89,59.23 69.19,58.93 69.19,58.83 66.45,56.08 63.09,56.08 60.96,53.95 RN1.4 60.96,50.8 60.86,50.7 60.86,49.58 RN2.4 60.96,48.87 59.84,47.75 59.84,47.65 56.79,44.6 56.79,42.06 52.02,37.29 52.02,35.46 51.61,35.05 51.61,33.12 42.77,24.28 42.77,23.88 42.88,23.77 42.88,21.95 42.77,21.84 42.77,21.54 43.18,21.13 43.18,14.53 36.88,8.23 36.88,7.62 IC5.D2
D3
  Top 0.254: J2.21 71.12,60.96 71.63,61.47 71.63,61.57 71.42,61.77 71.42,62.69 71.73,62.99 71.73,63.09 71.22,63.6 71.22,71.02 72.34,72.14 72.34,72.34 J1.21
  Bottom 0.254: IC5.D3 39.42,7.62 39.42,8.23 45.72,14.53 45.72,21.13 45.31,21.54 45.31,21.84 45.41,21.95 45.41,23.77 45.31,23.88 45.31,24.28 51.82,30.79 51.82,32.72 52.02,32.92 52.02,34.34 52.32,34.65 52.32,35.15 52.43,35.26 52.43,36.68 57.51,41.76 57.51,44.2 58.73,45.41 59.54,45.41 61.37,47.24 61.87,47.24 63.5,48.87 RN2.5 63.4,49.58 63.4,50.7 63.5,50.8 RN1.5 63.5,53.95 65.23,55.68 68.58,55.68 72.34,59.44 72.34,59.64 J2.21
D4
  Bottom 0.254: J1.22 73.66,73.66 73.15,73.15 73.15,73.05 73.36,72.85 73.36,71.93 73.05,71.63 73.05,71.53 73.56,71.02 73.56,63.6 72.44,62.48 72.44,62.28 J2.22 73.66,60.96 73.15,60.45 73.15,60.35 73.36,60.15 73.36,59.23 72.54,58.42 72.54,58.32 70.31,56.08 69.6,56.08 68.78,55.27 67.36,55.27 66.04,53.95 RN1.6 66.04,50.8 65.94,50.7 65.94,49.58 RN2.6 66.04,48.87 70.31,44.6 70.31,42.16 70.71,41.76 70.71,34.65 68.17,32.11 68.17,23.27 65.43,20.52 54.25,20.52 41.96,8.23 41.96,7.62 IC5.D4
D5
  Bottom 0.254: IC5.D5 44.5,7.62 44.5,8.23 56.39,20.12 65.63,20.12 71.53,26.01 71.53,44.81 68.58,47.75 68.58,48.26 68.48,48.36 68.48,49.38 68.58,49.48 RN2.7 68.48,49.58 68.48,50.7 68.58,50.8 RN1.7 68.58,53.95 70.31,55.68 71.12,55.68 74.88,59.44 74.88,59.64 J2.23 74.98,59.74 74.98,60.25 74.78,60.45 74.78,60.96 73.97,61.77 73.97,63.49 74.93,64.45 74.93,71.68 74.88,71.73 74.88,72.34 J1.23
D6
  Top 0.254: J1.24 73.15,73.15 73.15,73.05 73.36,72.85 73.36,71.93 73.05,71.63 73.05,71.53 73.97,70.61 73.97,63.8 74.98,62.79 74.98,62.28 J2.24
  Bottom 0.254: IC5.D6 47.04,7.62 47.04,8.23 58.52,19.71 65.84,19.71 71.93,25.81 71.93,46.94 71.12,47.75 71.12,48.26 71.02,48.36 71.02,49.38 71.12,49.48 RN2.8 71.02,49.58 71.02,50.7 71.12,50.8 RN1.8 71.12,53.95 72.24,55.07 72.24,55.37 75.08,58.22 75.08,58.42 75.89,59.23 75.89,60.15 75.69,60.35 75.69,60.45 76.2,60.96 J2.24
D7
  Top 0.254: J2.25 75.69,61.47 75.69,61.57 75.89,61.77 75.89,62.69 75.69,62.89 75.69,62.99 76.2,63.5 76.2,70.92 77.42,72.14 77.42,72.34 J1.25
  Bottom 0.254: IC5.D7 49.58,7.62 49.58,8.23 60.66,19.3 66.04,19.3 72.34,25.6 72.34,46.43 73.66,47.75 73.66,48.26 73.56,48.36 73.56,49.38 73.66,49.48 RN2.9 73.56,49.58 73.56,50.7 73.66,50.8 RN1.9 73.66,53.95 74.78,55.07 74.78,56.79 77.42,59.44 77.42,59.64 J2.25
DC
  Top 1.016: S2.2 13.92,14.02 13.41,14.02 13.31,14.12 12.9,14.12 12.8,14.22 12.7,14.22 10.77,16.15 9.04,16.15 8.74,16.46 J3.PWR
GND
  pour Top: -5.08,80.64 -5.08,-1.27 101.6,-1.27 101.6,1.27 101.6,79.38 101.6,80.64
  pour Bottom: -5.08,80.64 -5.08,-2.54 102.87,-2.54 102.87,80.64
N$1
  Top 0.254: C2.1 81.28,4.37 82.5,5.59 82.5,9.75 82.09,10.16 82.09,10.36 82.19,10.46 82.19,12.8 86.06,16.66 86.06,16.97 86.36,17.27 86.36,17.78 86.26,17.88 86.26,18.9 86.36,19 IC3.2 86.26,19.1 86.26,19.81 84.63,21.44 80.47,21.44 79.05,22.86 R1.2
N$2  (via drill 0.3)
  Top 0.254: IC3.3 83.82,19.71 82.5,21.03 79.86,21.03 79.05,21.84 78.33,21.84 77.52,22.66 77.42,22.66 71.53,28.55 71.53,30.89 v70.92,31.5 | v70.92,42.47 70.92,41.76 66.04,36.88 IC1.13
  Bottom 0.254: v70.92,31.5 70.92,34.24 71.12,34.44 71.12,42.27 v70.92,42.47
N$3  (via drill 0.3)
  Top 0.254: IC3.6 76.2,18.39 74.27,16.46 69.29,16.46 68.99,16.76 68.17,16.76 67.36,17.58 67.26,17.58 64.11,20.73 63.91,20.73 63.09,21.54 63.09,21.84 63.2,21.95 63.2,23.77 63.09,23.88 63.09,24.28 63.4,24.59 63.4,28.25 v63.2,28.45
  Bottom 0.254: v63.2,28.45 62.08,29.57 62.08,33.83 60.96,34.95 IC1.11
N$5
  Top 0.254: C2.2 86.36,4.37 88.7,6.71 88.7,6.81 89,7.11 89,7.52 R2.1 89,7.62 89,8.13 86.36,10.77 IC3.13
N$6  (via drill 0.3)
  Top 0.254: v36.98,32.72 36.98,27.03 35.15,25.2 35.15,21.54 36.17,20.52 42.27,20.52 54.56,8.23 54.56,7.62 IC5.SH
  Bottom 0.254: v36.98,32.72 36.98,40.03 33.83,43.18 33.83,46.02 38.1,50.29 38.1,50.8 38,50.9 38,51.92 38.1,52.02 IC7.LOAD
N$7  (via drill 0.3)
  Top 0.254: v42.27,21.13 42.88,20.52 44.81,20.52 57.1,8.23 57.1,7.62 IC5.MO
  Bottom 0.254: v42.27,21.13 42.27,20.83 41.96,20.52 36.17,20.52 31.5,25.2 31.5,40.64 33.43,42.57 33.43,50.49 35.05,52.12 35.56,52.12 IC7.SD
N$8  (via drill 0.3)
  Top 0.254: v43.08,35.15 48.16,30.07 48.16,24.59 47.85,24.28 47.85,23.88 47.95,23.77 47.95,21.95 47.85,21.84 47.85,21.54 48.87,20.52 49.89,20.52 62.18,8.23 62.18,7.62 IC5.0SY
  Bottom 0.254: v43.08,35.15 35.56,42.67 35.56,43.18 35.46,43.28 35.46,44.3 35.56,44.4 IC7.CLOCK
N$9
  Bottom 0.254: Q1.1 95,17.78 93.88,18.9 90.63,18.9 | 90.63,18.9 89,18.9 88.9,19 IC3.1 | 90.63,18.9 90.63,20.83 88.9,22.55 R1.1 C1.1
N$10
  Top 0.254: IC1.5 58.42,43.99 59.94,45.52 66.85,45.52 68.58,43.79 IC1.1
N$11
  Top 1.016: IC6.12 25.4,43.59 26.11,42.88 26.11,42.77 28.75,40.13 30.07,40.13 31.9,38.3 | 31.9,38.3 31.9,37.08 33.22,35.76 33.22,35.56 C8.+ | IC7.RB 40.64,43.59 40.54,43.48 40.54,43.18 35.97,38.61 32.31,38.61 31.9,38.3
N$12
  Top 0.254: IC1.10 58.42,36.37 57,37.8 57,41.45 55.88,42.57 IC1.6
N$13
  Top 1.016: IC7.MP 43.18,45.31 42.47,46.02 42.47,46.13 41.45,47.14 34.75,47.14 31.9,44.3 30.89,44.3 IC6.14 IC6.13
  Bottom 1.016: R6.2 10.26,40.64 10.87,40.03 10.97,40.03 12.39,38.61 19.51,38.61 21.44,40.54 21.54,40.54 21.64,40.64 | 21.64,40.64 R8.2 | 21.64,40.64 25.08,40.64 27.94,43.5 IC6.13
N$14
  Top 0.254: IC5./RD 52.12,22.86 52.12,22.25 59.94,14.43 69.49,14.43 72.34,11.58 73.56,11.58 73.66,11.48 IC3.8
N$15
  Top 1.016: R6.1 10.06,30.48 8.64,29.06 7.72,29.06 6.4,30.38 6.4,30.48 R7.1
  Bottom 1.016: IC6.6 17.78,51.21 17.07,50.49 17.07,50.39 12.19,45.52 12.19,44.7 8.43,40.95 8.43,39.83 8.23,39.62 8.23,32.51 10.16,30.58 R6.1
N$16
  Top 1.016: R9.2 27.94,69.8 27.84,69.8 23.98,65.94 23.98,62.48 22.66,61.16 22.66,60.96 C11.+
  Bottom 1.016: C11.+ 22.54,60.9 22.54,59.69 15.24,52.39 IC6.7 13.65,52.07 8.57,46.99 6.67,46.99 6.35,46.67 R7.2
N$18
  Bottom 1.016: IC6.3 25.4,52.93 26.11,53.65 26.11,53.75 27.13,54.76 38.91,54.76 40.13,53.54 40.13,52.83 40.64,52.32 IC7.TOBUFF
N$19
  Bottom 1.016: R4.1 14.02,30.48 14.02,30.58 22.05,38.61 26.82,38.61 29.97,41.76 31.29,41.76 32.51,42.98 32.51,51.1 31.8,51.82 31.6,51.82 31.5,51.92 30.99,51.92 30.89,52.02 30.48,52.02 IC6.1 30.07,52.22 28.65,52.22 28.55,52.12 27.94,52.12 IC6.2
N$20
  Top 1.016: R5.1 17.68,40.64 16.26,39.22 15.34,39.22 14.02,40.54 14.02,40.64 R4.2 13.61,40.95 12.5,42.06 12.5,43.18 10.77,44.91 10.77,45.01 10.16,45.62 C9.1
N$21
  Top 1.016: R5.2 17.78,31.11 19.84,33.18 | 19.84,33.18 24.77,38.1 C10.1 | IC6.10 20.32,42.23 19.68,41.59 19.68,33.34 19.84,33.18
N$22
  Top 1.016: IC6.9 17.78,44.4 17.68,44.3 17.58,44.3 17.27,44.6 15.95,44.6 15.85,44.5 15.24,44.5 IC6.8 14.83,44.6 14.22,44.6 14.12,44.7 13.92,44.7 13.21,45.41 13.21,47.55 | C9.2 10.16,50.7 10.77,50.09 10.77,49.99 13.21,47.55 | IC6.5 20.32,51.21 19.61,50.49 19.61,50.39 17.07,47.85 13.61,47.85 13.21,47.55
N$23  (via drill 0.3)
  Top 0.254: v57.91,15.54 56.29,15.54 49.58,22.25 49.58,22.86 IC5./CS
  Bottom 0.254: v57.91,15.54 64.01,15.54 67.97,19.51 70.21,19.51 73.05,16.66 78.23,16.66 79.65,18.09 79.65,20.42 87.17,27.94 87.17,29.87 90.53,33.22 93.47,33.22 95.2,34.95 95.2,35.56 IC4.19
N$24  (via drill 0.3)
  Top 0.254: v67.06,16.05 60.86,16.05 54.66,22.25 54.66,22.86 IC5./WR
  Bottom 0.254: v67.06,16.05 78.94,16.05 81.28,18.39 IC3.4
N$25
  Top 0.254: R3.1 34.24,26.62 34.24,26.42 33.22,25.4 33.22,23.37 30.48,20.62 LED1.A 30.48,20.12 32.21,18.39 32.21,14.22 32.72,13.72 31.8,12.8 31.8,11.48 J5.1
N$26
  Top 0.254: IC5.0M 75.59,7.62 78.74,10.77 IC3.10
N$28
  Top 0.254: R2.2 78.74,7.92 81.28,10.46 IC3.11
  Bottom 0.254: Q1.2 95,12.7 93.88,13.82 85.55,13.82 83.82,12.09 IC3.12 83.72,11.48 81.28,11.48 IC3.11
R/W  (via drill 0.3)
  Top 0.254: v45.82,69.09 45.82,71.83 45.92,71.93 45.92,73.25 45.62,73.56 45.62,73.76 46.74,74.88 46.94,74.88 J1.2 | IC3.9 76.2,12.09 72.24,16.05 67.97,16.05 63.5,20.52 57.61,20.52 56.19,21.95 56.19,23.77 56.29,23.88 56.29,24.28 55.98,24.59 55.98,27.43 57.2,28.65 | 57.2,28.65 63.5,34.95 IC1.12 | 57.2,28.65 v50.39,35.46
  Bottom 0.254: v45.82,69.09 45.82,63.6 46.94,62.48 46.94,62.28 J2.2 46.84,62.28 45.21,60.66 45.21,56.69 50.39,51.51 v50.39,35.46
VCC
  Top 1.016: 26.82,20.22 26.82,9.86 28.14,8.53 28.65,8.53 29.06,8.13 29.06,7.01 29.16,6.91 29.16,6.4 TR1.S | 26.82,20.22 25.4,21.64 C3.1 | 26.77,24.03 27.43,23.37 27.43,20.73 27.23,20.52 26.82,20.22 | 26.77,24.03 25.65,25.15 | 25.65,25.15 R3.2 | C6.+ 12.9,21.64 12.9,22.55 14.94,24.59 25.09,24.59 25.65,25.15 | 92.86,24.18 92.86,14.33 90.12,11.58 89.61,11.58 89.51,11.48 88.9,11.48 IC3.14 | 96.37,27.69 97.84,29.16 C4.1 | 96.37,27.69 92.86,24.18 | IC4.20 97.74,35.56 97.74,34.85 97.23,34.34 97.23,34.04 95.71,32.51 95.71,28.35 96.37,27.69 | IC6.4 22.86,52.93 23.57,53.65 23.57,53.75 24.59,54.76 41.45,54.76 42.01,54.2 | 42.01,54.2 42.67,53.54 42.67,52.83 43.18,52.32 IC7.VDD | RN1.1 52.83,53.34 52.63,53.54 51.31,53.54 | 45.21,53.54 51.31,53.54 | 45.21,53.54 43.99,54.76 42.57,54.76 42.01,54.2 | C7.1 68.58,17.88 67.97,18.49 67.97,18.59 66.85,19.71 66.85,21.84 66.4,22.3 | 66.4,22.3 66.04,22.66 65.43,22.66 65.23,22.86 IC5.VSS | 66.29,27.69 66.85,27.13 66.85,22.76 66.4,22.3 | 66.29,27.69 C5.1 | IC1.14 69.09,35.56 69.29,35.76 70,35.76 70.51,35.26 | 70.51,35.26 70.61,35.15 70.61,32.92 | 70.61,32.92 66.85,29.16 66.85,28.25 66.29,27.69 | 70.51,35.26 76.91,41.66 76.91,41.96 77.42,42.47 77.42,43.18 IC4.9 77.52,43.59 77.42,43.69 77.32,43.69 77.01,43.99 77.01,44.6 75.59,46.02 75.59,48.16 75.39,48.36 75.39,50.7 75.59,50.9 75.59,51.92 77.01,53.34 | 77.01,53.34 RN3.1 | 51.31,53.54 51.31,54.86 52.43,55.98 74.57,55.98 75.59,54.97 75.59,54.66 76.61,53.65 77.01,53.34 | 92.86,24.18 92.46,24.49 90.22,24.49 87.58,27.13 76.81,27.13 71.32,32.61 71.02,32.61 70.61,32.92 | 26.77,24.03 45.21,42.47 45.21,53.54
YM/IRQ  (via drill 0.3)
  Top 0.254: v46.43,38.51 v52.53,32.41 | S1.2 31.75,73.66 32.7,72.71 35.83,72.71 v35.87,72.75
  Bottom 0.254: v52.53,32.41 53.24,32.41 62.18,23.47 62.18,22.86 IC5./IRQ | v46.43,38.51 46.43,54.86 35.87,65.43 v35.87,72.75

### Text on the board
bPlace: BeebOPL Rev. 1.01 / 31.10.2016 Robert Lazarus / https://github.com/lazarusr/beebopl
tValues: Y3014B | 5V only unless / LM7805 fitted | 5V (12V) | 5V | Bob's board | YM3812 | 12V | - | + | 5V | GND | GND | 12V